# Altium schematic sheet self_balance1.0.SchDoc
size A3
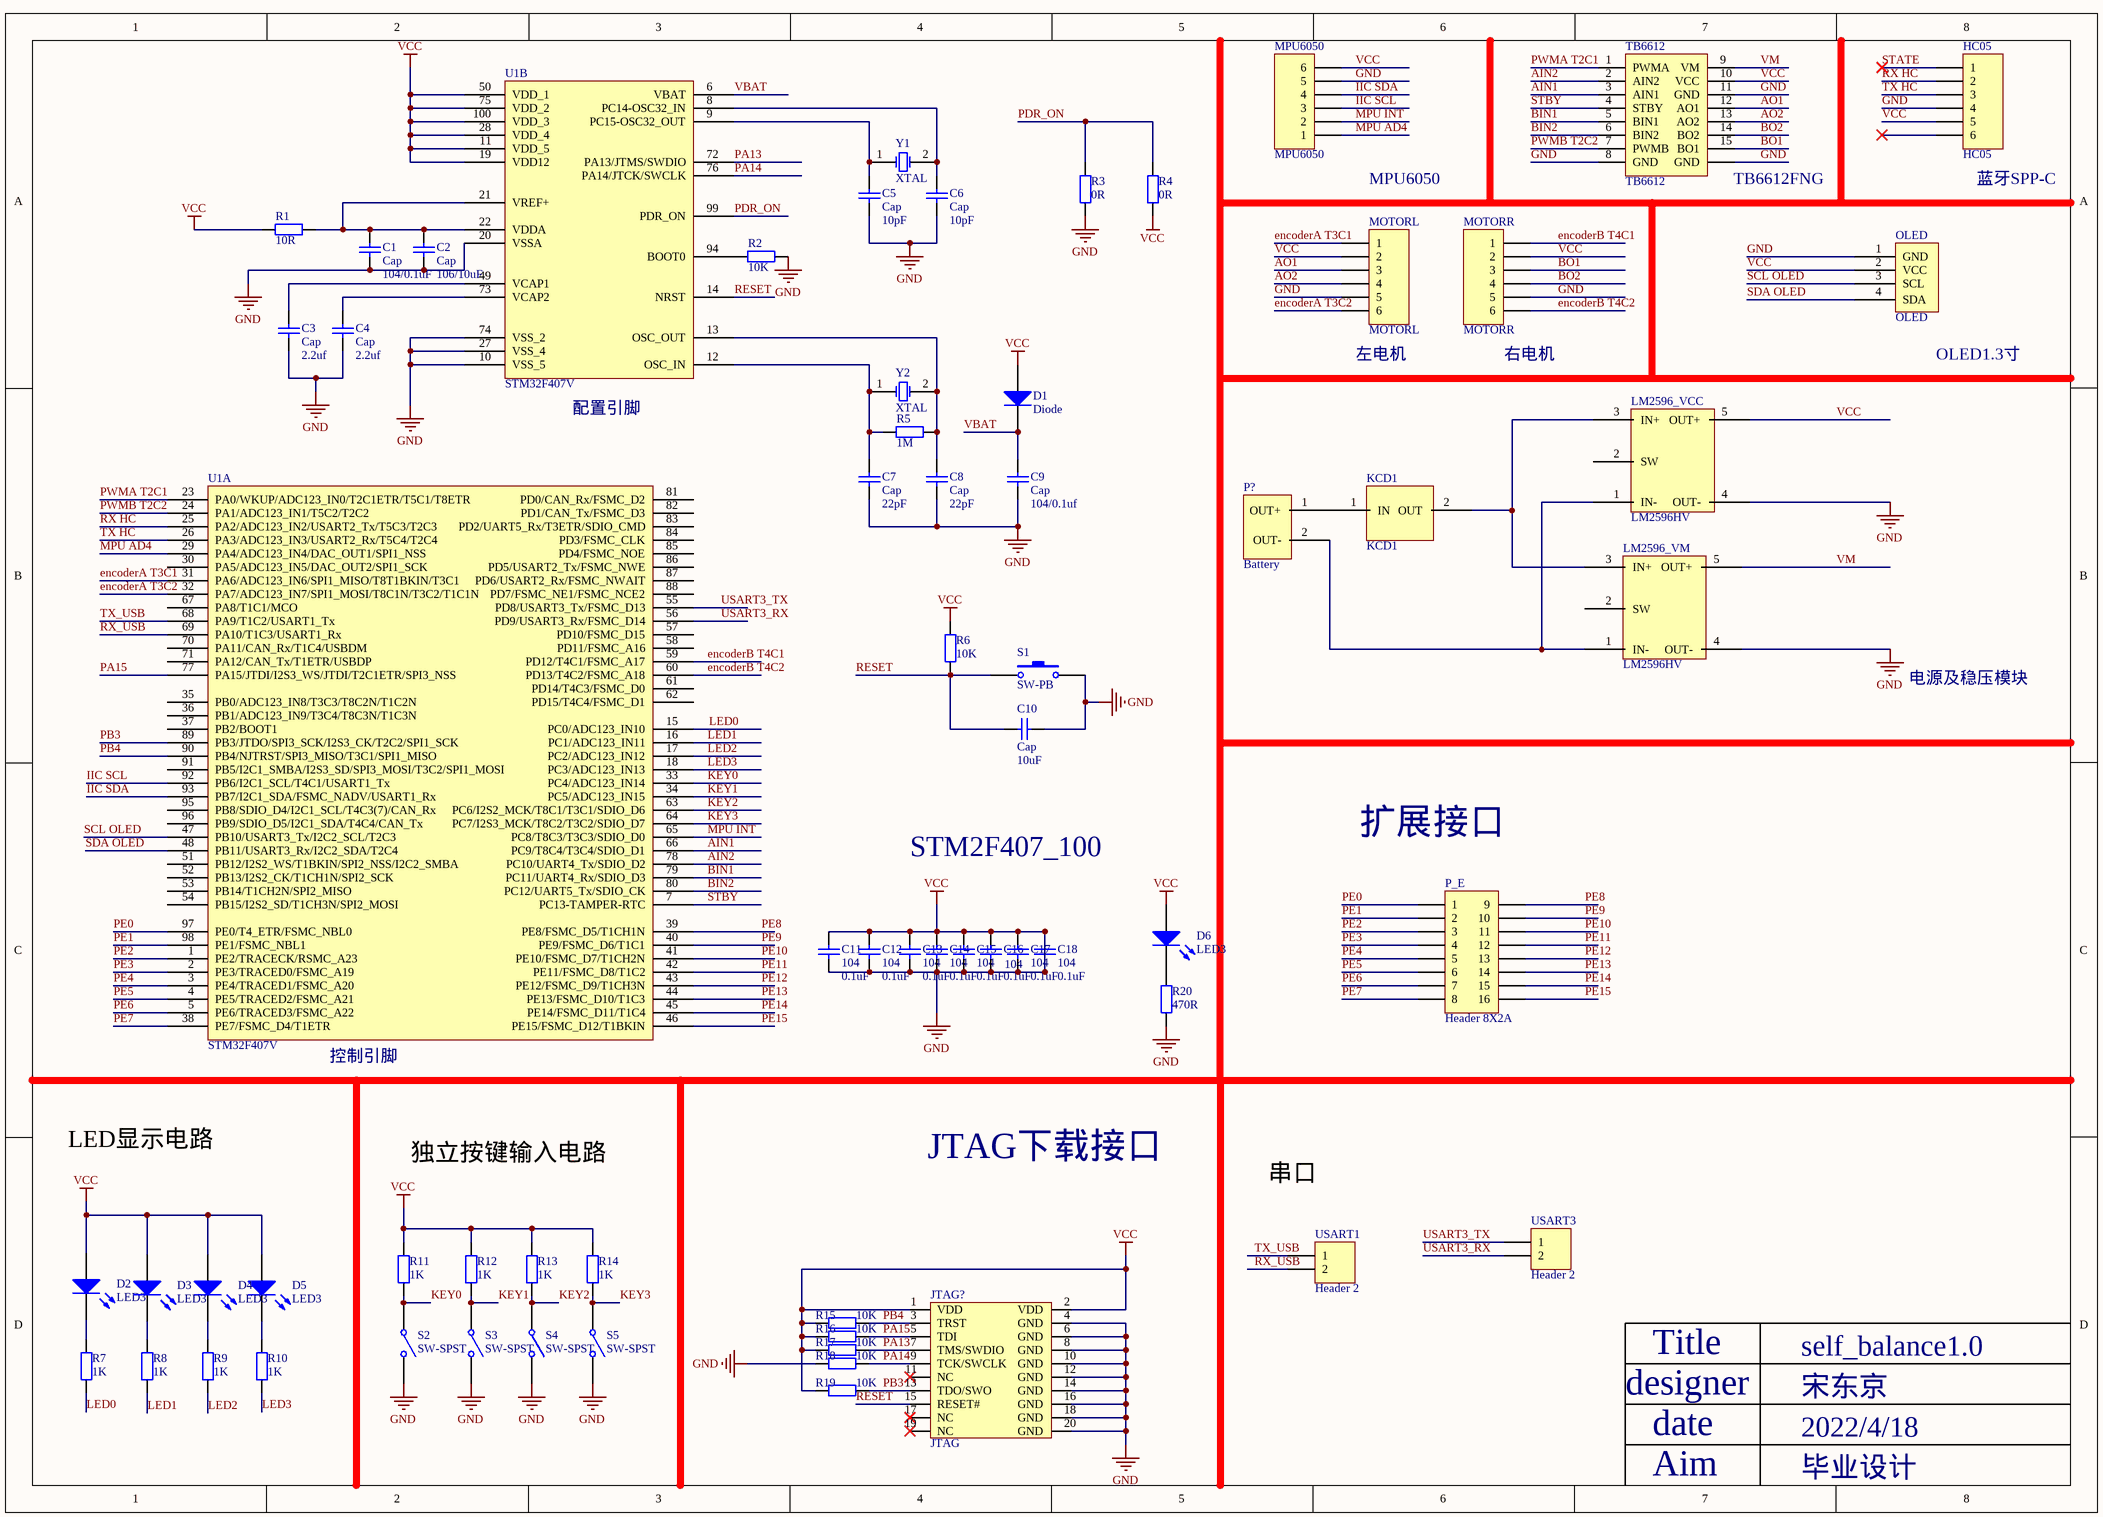
[diagram p0: self_balance1.0.SchDoc]

## Parts
C1  Cap  value 104/0.1uF  [RAD-0.3]
C2  Cap  value 106/10uF  [RAD-0.3]
C3  Cap  value 2.2uf  [RAD-0.3]
C4  Cap  value 2.2uf  [RAD-0.3]
C5  Cap  value 10pF  [RAD-0.3]
C6  Cap  value 10pF  [RAD-0.3]
C7  Cap  value 22pF  [RAD-0.3]
C8  Cap  value 22pF  [RAD-0.3]
C9  Cap  value 104/0.1uf  [RAD-0.3]
C10  Cap  value 10uF  [RAD-0.3]
C11  104  value 0.1uF  [RAD-0.3]
C12  104  value 0.1uF  [RAD-0.3]
C13  104  value 0.1uF  [RAD-0.3]
C14  104  value 0.1uF  [RAD-0.3]
C15  104  value 0.1uF  [RAD-0.3]
C16  104  value 0.1uF  [RAD-0.3]
C17  104  value 0.1uF  [RAD-0.3]
C18  104  value 0.1uF  [RAD-0.3]
D1  Diode  [SMC]
D2  LED3  [3.5X2.8X1.9]
D3  LED3  [3.5X2.8X1.9]
D4  LED3  [3.5X2.8X1.9]
D5  LED3  [3.5X2.8X1.9]
D6  LED3  [3.5X2.8X1.9]
HC05  HC05  [HDR1X6]
JTAG?  JTAG  [JTAG_20]
KCD1  KCD1  [KCD1]
LM2596_VCC  LM2596HV  [LM2596HV]
LM2596_VM  LM2596HV  [LM2596HV]
MOTORL  MOTORL  [HDR1X6]
MOTORR  MOTORR  [HDR1X6]
MPU6050  MPU6050  [HDR1X6]
OLED  OLED  [OLED]
P?  Battery  [电源底座]
P_E  Header 8X2A  [HDR2X8_CEN]
R1  10R  [0603]
R2  10K  [0603]
R3  0R  [0603]
R4  0R  [0603]
R5  1M  [0603]
R6  10K  [0603]
R7  1K  [0603]
R8  1K  [0603]
R9  1K  [0603]
R10  1K  [0603]
R11  1K  [0603]
R12  1K  [0603]
R13  1K  [0603]
R14  1K  [0603]
R15  10K  [0603]
R16  10K  [0603]
R17  10K  [0603]
R18  10K  [0603]
R19  10K  [0603]
R20  470R  [0603]
S1  SW-PB  [SPST-2]
S2  SW-SPST  [SPST-2]
S3  SW-SPST  [SPST-2]
S4  SW-SPST  [SPST-2]
S5  SW-SPST  [SPST-2]
TB6612  TB6612  [TB6612]
U1  STM32F407V  [LQFP-100_M]  (parts A,B of 2)
USART1  Header 2  [HDR1X2]
USART3  Header 2  [HDR1X2]
Y1  XTAL  [R38]
Y2  XTAL  [R38]

## Nets
GND: C1.1 C2.1 C3.1 C4.1 C5.1 C6.1 C7.1 C8.1 C9.1 C10.1 C11.1 C11.2 C12.1 C12.2 C13.1 C13.2 C14.1 C14.2 C15.1 C15.2 C16.1 C16.2 C17.1 C17.2 C18.1 C18.2 D1.1(A) D2.1(A) D3.1(A) D4.1(A) D5.1(A) D6.1(A) HC05.4 HC05.5 JTAG?.1(VDD) JTAG?.2(VDD) JTAG?.4(GND) JTAG?.6(GND) JTAG?.8(GND) JTAG?.10(GND) JTAG?.12(GND) JTAG?.14(GND) JTAG?.16(GND) JTAG?.18(GND) JTAG?.20(GND) LM2596_VCC.4(OUT-) LM2596_VCC.5(OUT+) LM2596_VM.4(OUT-) MOTORL.2 MOTORL.5 MOTORR.2 MOTORR.5 MPU6050.5 MPU6050.6 OLED.1(GND) OLED.2(VCC) R1.2 R2.1 R3.2 R4.2 R6.1 R11.2 R12.2 R13.2 R14.1 R15.1 R16.1 R17.1 R18.1 R19.1 R20.2 S1.2 S2.2(NO) S3.2(NO) S4.2(NO) S5.2(NO) TB6612.8(GND) TB6612.10(VCC) TB6612.11(GND) TB6612.16(GND) U1.10(VSS_5) U1.11(VDD_5) U1.19(VDD12) U1.20(VSSA) U1.27(VSS_4) U1.28(VDD_4) U1.50(VDD_1) U1.74(VSS_2) U1.75(VDD_2) U1.100(VDD_3)  [also labelled VCC]
AIN1: TB6612.3(AIN1) U1.66(PC9/T8C4/T3C4/SDIO_D1)
AIN2: TB6612.2(AIN2) U1.78(PC10/UART4_Tx/SDIO_D2)
AO1: MOTORL.3 TB6612.12(AO1)
AO2: MOTORL.4 TB6612.13(AO2)
BIN1: TB6612.5(BIN1) U1.79(PC11/UART4_Rx/SDIO_D3)
BIN2: TB6612.6(BIN2) U1.80(PC12/UART5_Tx/SDIO_CK)
BO1: MOTORR.3 TB6612.15(BO1)
BO2: MOTORR.4 TB6612.14(BO2)
encoderA T3C1: MOTORL.1 U1.31(PA6/ADC123_IN6/SPI1_MISO/T8T1BKIN/T3C1)
encoderA T3C2: MOTORL.6 U1.32(PA7/ADC123_IN7/SPI1_MOSI/T8C1N/T3C2/T1C1N)
encoderB T4C1: MOTORR.1 U1.59(PD12/T4C1/FSMC_A17)
encoderB T4C2: MOTORR.6 U1.60(PD13/T4C2/FSMC_A18)
IIC SCL: MPU6050.3 U1.92(PB6/I2C1_SCL/T4C1/USART1_Tx)
IIC SDA: MPU6050.4 U1.93(PB7/I2C1_SDA/FSMC_NADV/USART1_Rx)
KEY0: R11.1 S2.1(COMMON) U1.33(PC4/ADC123_IN14)
KEY1: R12.1 S3.1(COMMON) U1.34(PC5/ADC123_IN15)
KEY2: R13.1 S4.1(COMMON) U1.63(PC6/I2S2_MCK/T8C1/T3C1/SDIO_D6)
KEY3: R14.2 S5.1(COMMON) U1.64(PC7/I2S3_MCK/T8C2/T3C2/SDIO_D7)
LED0: R7.1 U1.15(PC0/ADC123_IN10)
LED1: R8.1 U1.16(PC1/ADC123_IN11)
LED2: R9.1 U1.17(PC2/ADC123_IN12)
LED3: R10.1 U1.18(PC3/ADC123_IN13)
MPU AD4: MPU6050.1 U1.29(PA4/ADC123_IN4/DAC_OUT1/SPI1_NSS)
MPU INT: MPU6050.2 U1.65(PC8/T8C3/T3C3/SDIO_D0)
PA13: JTAG?.7(TMS/SWDIO) R17.2 U1.72(PA13/JTMS/SWDIO)
PA14: JTAG?.9(TCK/SWCLK) R18.2 U1.76(PA14/JTCK/SWCLK)
PA15: JTAG?.5(TDI) R16.2 U1.77(PA15/JTDI/I2S3_WS/JTDI/T2C1ETR/SPI3_NSS)
PB3: JTAG?.13(TDO/SWO) R19.2 U1.89(PB3/JTDO/SPI3_SCK/I2S3_CK/T2C2/SPI1_SCK)
PB4: JTAG?.3(TRST) R15.2 U1.90(PB4/NJTRST/SPI3_MISO/T3C1/SPI1_MISO)
PDR_ON: R3.1 R4.1 U1.99(PDR_ON)
PE0: P_E.1 U1.97(PE0/T4_ETR/FSMC_NBL0)
PE1: P_E.2 U1.98(PE1/FSMC_NBL1)
PE2: P_E.3 U1.1(PE2/TRACECK/RSMC_A23)
PE3: P_E.4 U1.2(PE3/TRACED0/FSMC_A19)
PE4: P_E.5 U1.3(PE4/TRACED1/FSMC_A20)
PE5: P_E.6 U1.4(PE5/TRACED2/FSMC_A21)
PE6: P_E.7 U1.5(PE6/TRACED3/FSMC_A22)
PE7: P_E.8 U1.38(PE7/FSMC_D4/T1ETR)
PE8: P_E.9 U1.39(PE8/FSMC_D5/T1CH1N)
PE9: P_E.10 U1.40(PE9/FSMC_D6/T1C1)
PE10: P_E.11 U1.41(PE10/FSMC_D7/T1CH2N)
PE11: P_E.12 U1.42(PE11/FSMC_D8/T1C2)
PE12: P_E.13 U1.43(PE12/FSMC_D9/T1CH3N)
PE13: P_E.14 U1.44(PE13/FSMC_D10/T1C3)
PE14: P_E.15 U1.45(PE14/FSMC_D11/T1C4)
PE15: P_E.16 U1.46(PE15/FSMC_D12/T1BKIN)
PWMA T2C1: TB6612.1(PWMA) U1.23(PA0/WKUP/ADC123_IN0/T2C1ETR/T5C1/T8ETR)
PWMB T2C2: TB6612.7(PWMB) U1.24(PA1/ADC123_IN1/T5C2/T2C2)
RESET: C10.2 JTAG?.15(RESET#) R6.2 S1.1 U1.14(NRST)
RX HC: HC05.2 U1.25(PA2/ADC123_IN2/USART2_Tx/T5C3/T2C3)
RX_USB: U1.69(PA10/T1C3/USART1_Rx) USART1.2
SCL OLED: OLED.3(SCL) U1.47(PB10/USART3_Tx/I2C2_SCL/T2C3)
SDA OLED: OLED.4(SDA) U1.48(PB11/USART3_Rx/I2C2_SDA/T2C4)
STATE: HC05.1
STBY: TB6612.4(STBY) U1.7(PC13-TAMPER-RTC)
TX HC: HC05.3 U1.26(PA3/ADC123_IN3/USART2_Rx/T5C4/T2C4)
TX_USB: U1.68(PA9/T1C2/USART1_Tx) USART1.1
USART3_RX: U1.56(PD9/USART3_Rx/FSMC_D14) USART3.2
USART3_TX: U1.55(PD8/USART3_Tx/FSMC_D13) USART3.1
VBAT: C9.2 D1.2(K) U1.6(VBAT)
VM: LM2596_VM.5(OUT+) TB6612.9(VM)
NetC1_2: C1.2 C2.2 R1.1 U1.21(VREF+) U1.22(VDDA)
NetC3_2: C3.2 U1.49(VCAP1)
NetC4_2: C4.2 U1.73(VCAP2)
NetC5_2: C5.2 U1.9(PC15-OSC32_OUT) Y1.1(OSC1)
NetC6_2: C6.2 U1.8(PC14-OSC32_IN) Y1.2(OSC2)
NetC7_2: C7.2 R5.2 U1.12(OSC_IN) Y2.1(OSC1)
NetC8_2: C8.2 R5.1 U1.13(OSC_OUT) Y2.2(OSC2)
NetD2_2: D2.2(K) R7.2
NetD3_2: D3.2(K) R8.2
NetD4_2: D4.2(K) R9.2
NetD5_2: D5.2(K) R10.2
NetD6_2: D6.2(K) R20.1
NetKCD1_1: KCD1.1(IN) P?.1(OUT+)
NetKCD1_2: KCD1.2(OUT) LM2596_VCC.3(IN+) LM2596_VM.3(IN+)
NetLM2596_VCC_1: LM2596_VCC.1(IN-) LM2596_VM.1(IN-) P?.2(OUT-)
NetR2_2: R2.2 U1.94(BOOT0)

Not connected (* = marked no-connect by the designer): HC05 6*; JTAG? 11(NC)* 17(NC)* 19(NC)*; LM2596_VCC 2(SW); LM2596_VM 2(SW); U1 30(PA5/ADC123_IN5/DAC_OUT2/SPI1_SCK) 35(PB0/ADC123_IN8/T3C3/T8C2N/T1C2N) 36(PB1/ADC123_IN9/T3C4/T8C3N/T1C3N) 37(PB2/BOOT1) 51(PB12/I2S2_WS/T1BKIN/SPI2_NSS/I2C2_SMBA) 52(PB13/I2S2_CK/T1CH1N/SPI2_SCK) 53(PB14/T1CH2N/SPI2_MISO) 54(PB15/I2S2_SD/T1CH3N/SPI2_MOSI) 57(PD10/FSMC_D15) 58(PD11/FSMC_A16) 61(PD14/T4C3/FSMC_D0) 62(PD15/T4C4/FSMC_D1) 67(PA8/T1C1/MCO) 70(PA11/CAN_Rx/T1C4/USBDM) 71(PA12/CAN_Tx/T1ETR/USBDP) 81(PD0/CAN_Rx/FSMC_D2) 82(PD1/CAN_Tx/FSMC_D3) 83(PD2/UART5_Rx/T3ETR/SDIO_CMD) 84(PD3/FSMC_CLK) 85(PD4/FSMC_NOE) 86(PD5/USART2_Tx/FSMC_NWE) 87(PD6/USART2_Rx/FSMC_NWAIT) 88(PD7/FSMC_NE1/FSMC_NCE2) 91(PB5/I2C1_SMBA/I2S3_SD/SPI3_MOSI/T3C2/SPI1_MOSI) 95(PB8/SDIO_D4/I2C1_SCL/T4C3(7)/CAN_Rx) 96(PB9/SDIO_D5/I2C1_SDA/T4C4/CAN_Tx)

## Notes on the sheet
- MPU6050
- (near TB6612) TB6612FNG
- (near HC05) 蓝牙SPP-C
- (near MOTORL) 左电机
- (near MOTORR) 右电机
- OLED1.3寸
- (near U1) 配置引脚
- 电源及稳压模块
- STM2F407_100
- 扩展接口
- (near U1) 控制引脚
- LED显示电路
- 独立按键输入电路
- JTAG下载接口
- 串口
- designer
- Title
- self_balance1.0
- 宋东京
- date
- 2022/4/18
- Aim
- 毕业设计

## Library data of the parts
C1-C18 = Cap: Capacitor; Published: 8-Jun-2000; LatestRevisionDate: 17-Jul-2002; LatestRevisionNote: Re-released for DXP Platform.; PackageReference: RAD-0.3; Publisher: Altium Limited; PackageDescription: Radial Cap, Thru-Hole; 2 Leads; 0.3 in Pin Spacing
D1 = Diode: Default Diode; Published: 8-Jun-2000; LatestRevisionDate: 17-Jul-2002; LatestRevisionNote: Re-released for DXP Platform.; PackageVersion: Sep-1996; PackageReference: SMC; Publisher: Altium Limited; PackageDescription: DO-214-AB/SMC; 2 C-Bend Leads; Body 7.9 x 5.9 mm, inc. leads (LxW); Code_JEDEC: DO-214-AB
D2-D6 = LED3: Typical BLUE SiC LED; Published: 8-Jun-2000; LatestRevisionDate: 17-Dec-2003; LatestRevisionNote: PCB Footprint replaced.; DatasheetVersion: 16-Apr-2002; PackageVersion: 16-Apr-2002; PackageReference: 3.5X2.8X1.9; Publisher: Altium Limited; PackageDescription: SM LED; 2 C-Bend Leads; Body 3.5 x 2.8 x 1.9 mm, inc leads (LxWxH typ)
HC05 MOTORL MOTORR MPU6050 = Header 6: Header, 6-Pin; LatestRevisionDate: 17-Jul-2002; LatestRevisionNote: Re-released for DXP Platform.; Publisher: Altium Limited
P_E = Header 8X2A: Header, 8-Pin, Dual row; LatestRevisionDate: 17-Jul-2002; LatestRevisionNote: Re-released for DXP Platform.; Publisher: Altium Limited
R1-R20 = Res2: Resistor; Published: 8-Jun-2000; LatestRevisionDate: 17-Jul-2002; LatestRevisionNote: Re-released for DXP Platform.; PackageReference: AXIAL-0.4; Publisher: Altium Limited; PackageDescription: Axial Device, Thru-Hole; 2 Leads; 0.4 in Pin Spacing
  R1: Value: 10R
  R2 R6 R15-R19: Value: 10K
  R3 R4: Value: 0R
  R5: Value: 1M
  R7-R14: Value: 1K
  R20: Value: 470R
S1 = SW-PB: Switch; Published: 24-Mar-1999; LatestRevisionDate: 17-Jul-2002; LatestRevisionNote: Re-released for DXP Platform.; PackageReference: SPST-2; Publisher: Altium Limited; PackageDescription: Switch; 2 Leads
S2-S5 = SW-SPST: Single-Pole, Single-Throw Switch; Published: 24-Mar-1999; LatestRevisionDate: 17-Jul-2002; LatestRevisionNote: Re-released for DXP Platform.; PackageReference: SPST-2; Publisher: Altium Limited; PackageDescription: Switch; 2 Leads
U1 = STM32F407V: STM32单片机100引脚
USART1 USART3 = Header 2: Header, 2-Pin; LatestRevisionDate: 17-Jul-2002; LatestRevisionNote: Re-released for DXP Platform.; Publisher: Altium Limited
Y1 Y2 = XTAL: Crystal Oscillator; Published: 8-Jun-2000; LatestRevisionDate: 17-Jul-2002; LatestRevisionNote: Re-released for DXP Platform.; PackageReference: R38; Publisher: Altium Limited; PackageDescription: Crystal, Thru-Hole; 2 Leads; Body 3.1 x 8.2 mm (Dia.xH)
TB6612 = TB6612: LatestRevisionDate: 17-Jul-2002; LatestRevisionNote: Re-released for DXP Platform.; Publisher: Altium Limited